# Altium schematic sheet StandardDSUB.SchDoc
size A; SheetNumber: 2; SheetTotal: 2
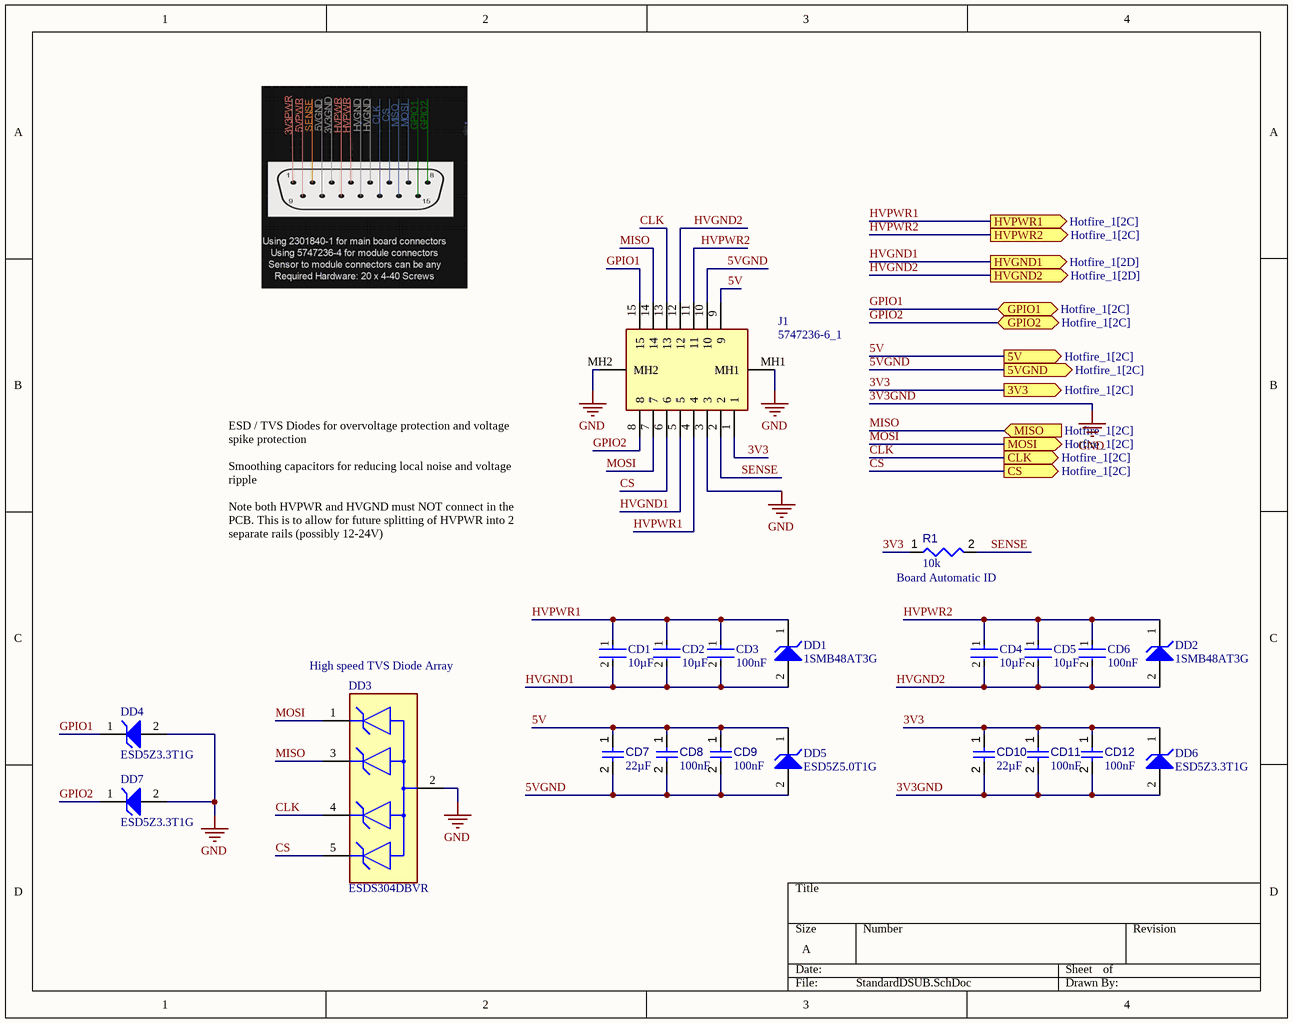
[diagram p0: StandardDSUB.SchDoc]

## Parts
CD1  value 10µF  [FP-CL32-IPC_B]  (hidden comment: CL32B106KMVNNWE)
CD2  value 10µF  [FP-CL32-IPC_B]  (hidden comment: CL32B106KMVNNWE)
CD3  value 100nF  [FP-CL10-IPC_B]  (hidden comment: CL10B104KC8NNNC)
CD4  value 10µF  [FP-CL32-IPC_B]  (hidden comment: CL32B106KMVNNWE)
CD5  value 10µF  [FP-CL32-IPC_B]  (hidden comment: CL32B106KMVNNWE)
CD6  value 100nF  [FP-CL10-IPC_B]  (hidden comment: CL10B104KC8NNNC)
CD7  value 22µF  [CAPC0805(2012)145_L]  (hidden comment: Capacitor 22µF +/-40% 16V 0805)
CD8  value 100nF  [CAPC2013X95X50LL10T25]  (hidden comment: Capacitor 100 nF +/-10% 50 V 0805)
CD9  value 100nF  [CAPC2013X95X50LL10T25]  (hidden comment: Capacitor 100 nF +/-10% 50 V 0805)
CD10  value 22µF  [CAPC0805(2012)145_L]  (hidden comment: Capacitor 22µF +/-40% 16V 0805)
CD11  value 100nF  [CAPC2013X95X50LL10T25]  (hidden comment: Capacitor 100 nF +/-10% 50 V 0805)
CD12  value 100nF  [CAPC2013X95X50LL10T25]  (hidden comment: Capacitor 100 nF +/-10% 50 V 0805)
DD1  1SMB48AT3G  [ONSC-SMB-2-403A-03_H_V]
DD2  1SMB48AT3G  [ONSC-SMB-2-403A-03_H_V]
DD3  ESDS304DBVR  [FP-DBV0005A-IPC_B]
DD4  ESD5Z3.3T1G  [ONSC-SOD-523-2-502-01_V]
DD5  ESD5Z5.0T1G  [ONSC-SOD-523-2-502-01_V]
DD6  ESD5Z3.3T1G  [ONSC-SOD-523-2-502-01_V]
DD7  ESD5Z3.3T1G  [ONSC-SOD-523-2-502-01_V]
J1  5747236-6_1  [57472366]
R1  value 10k  [RESC2013X50X35ML15T15]  (hidden comment: Resistor 10k +/-1% 0805 125 mW)

## Ports
3V3 (out, see Hotfire_1[2C]), 5V (out, see Hotfire_1[2C]), 5VGND (out, see Hotfire_1[2C]), CLK (out, see Hotfire_1[2C]), CS (out, see Hotfire_1[2C]), GPIO1 (bidir, see Hotfire_1[2C]), GPIO2 (bidir, see Hotfire_1[2C]), HVGND1 (out, see Hotfire_1[2D]), HVGND2 (out, see Hotfire_1[2D]), HVPWR1 (out, see Hotfire_1[2C]), HVPWR2 (out, see Hotfire_1[2C]), MISO (in, see Hotfire_1[2C]), MOSI (out, see Hotfire_1[2C])

## Nets
3V3GND: CD10.2 CD11.2 CD12.2 DD3.2(GND) DD4.2(A) DD6.2(A) DD7.2(A) J1.3 J1.MH1 J1.MH2  [also labelled GND]
3V3: CD10.1 CD11.1 CD12.1 DD6.1(K) J1.1 R1.1 ; port 3V3
5V: CD7.1 CD8.1 CD9.1 DD5.1(K) J1.9 ; port 5V
5VGND: CD7.2 CD8.2 CD9.2 DD5.2(A) J1.10 ; port 5VGND
CLK: DD3.4(I/O3) J1.13 ; port CLK
CS: DD3.5(I/O4) J1.6 ; port CS
GPIO1: DD4.1(K) J1.15 ; port GPIO1
GPIO2: DD7.1(K) J1.8 ; port GPIO2
HVGND1: CD1.2 CD2.2 CD3.2 DD1.2(A) J1.5 ; port HVGND1
HVGND2: CD4.2 CD5.2 CD6.2 DD2.2(A) J1.12 ; port HVGND2
HVPWR1: CD1.1 CD2.1 CD3.1 DD1.1(K) J1.4 ; port HVPWR1
HVPWR2: CD4.1 CD5.1 CD6.1 DD2.1(K) J1.11 ; port HVPWR2
MISO: DD3.3(I/O2) J1.14 ; port MISO
MOSI: DD3.1(I/O1) J1.7 ; port MOSI
SENSE: J1.2 R1.2

## Notes on the sheet
- ESD / TVS Diodes for overvoltage protection and voltage spike protection
  Smoothing capacitors for reducing local noise and voltage ripple
  Note both HVPWR and HVGND must NOT connect in the PCB. This is to allow for future splitting of HVPWR into 2 separate rails (possibly 12-24V)
- (near R1) Board Automatic ID
- (near DD3) High speed TVS Diode Array

## Library data of the parts
CD1 CD2 CD4 CD5 = CMP-001-00107-1: Ceramic Capacitor, Multilayer, Ceramic, 63V, 10% +Tol, 10% -Tol, X7R, 15% TC, 10uF, Surface Mount, 1210; Max Operating Temperature: 125°C; RoHS Compliant: Yes; Case/Package: 1210; Mounting Technology: Surface Mount; Capacitor Type: Ceramic; Pins: 2; Min Operating Temperature: -55°C
CD3 CD6 = CMP-001-00108-1: Ceramic Capacitor, Multilayer, Ceramic, 100V, 10% +Tol, 10% -Tol, X7R, 15% TC, 0.1uF, Surface Mount, 0603; Mounting Technology: Surface Mount; Max Operating Temperature: 125°C; Case/Package: 0603; Capacitor Type: Ceramic; Pins: 2; Min Operating Temperature: -55°C; RoHS Compliant: Yes
CD7 CD10 = CMP-001-00081-4: Chip Capacitor, 22µF +/-40%, 16V, 0805, Thickness 1.45 mm; Tolerance: 5%; Voltage Rating: 16V; Mounting Technology: SMT; Pins: 2; Max Operating Temperature: 85°C; Case/Package: 0805; Min Operating Temperature: -55°C
CD8 CD9 CD11 CD12 = CMP-001-00018-6: Chip Capacitor, 100 nF, +/- 10%, 50 V, 0805 (2012 Metric); Capacitor Type: Ceramic; Voltage Rating: 50V; Pins: 2; Max Operating Temperature: 125°C; Min Operating Temperature: -55°C; Mounting Technology: SM; Case/Package: 0805; RoHS Compliant: True; Tolerance: 10%
DD1 DD2 = CMP-004-00036-1: Trans Voltage Suppressor Diode, 600W, 48V V(RWM), Unidirectional, 1 Element, Silicon, DO-214AA; RoHS Compliant: Yes; Pins: 2; Min Operating Temperature: -65°C; Max Operating Temperature: 150°C
DD3 = CMP-004-00037-1: Trans Voltage Suppressor Diode, 85W, 3.6V V(RWM), Unidirectional, 4 Element, Silicon; RoHS Compliant: Yes
DD4 DD6 DD7 = CMP-004-00034-1: Trans Voltage Suppressor Diode, 158W, 3.3V V(RWM), Unidirectional, 1 Element, Silicon; Min Operating Temperature: -55°C; RoHS Compliant: Yes; Pins: 2; Max Operating Temperature: 150°C
DD5 = CMP-004-00035-1: Trans Voltage Suppressor Diode, 240W, 5V V(RWM), Unidirectional, 1 Element, Silicon; Max Operating Temperature: 150°C; Min Operating Temperature: -55°C; RoHS Compliant: Yes; Pins: 2
J1 = CMP-031-000002-4: Male 15 pin DSUB, Used for Hotfire Modules - can connect to Hotfire main board; Manufacturer_Name: TE Connectivity; Source: SamacSys.SchLib; Height: 12.93mm; Arrow Price/Stock: https://www.arrow.com/en/products/5747236-6/te-connectivity; Mouser Price/Stock: https://www.mouser.co.uk/ProductDetail/TE-Connectivity/5747236-6?qs=2De2tSDgB03zVLI%252B5IT1Bw%3D%3D; Mouser Part Number: 571-5747236-6; Manufacturer_Part_Number: 5747236-6; Design Item ID: 5747236-6_1; Datasheet Link: https://www.te.com/commerce/DocumentDelivery/DDEController?Action=srchrtrv&DocNm=82068_AMPLIMITE_Right-Angle_Posted_Conn&DocType=Catalog%20Section&DocLang=English&PartCntxt=5747236-6&DocFormat=pdf; Arrow Part Number: 5747236-6
R1 = CMP-009-00018-5: Chip Resistor, 10 KOhm, +/- 1%, 125 mW, -55 to 155 degC, 0805 (2012 Metric); Power: 125mW; Voltage Rating: 150V; Tolerance: 1%; Pins: 2; Min Operating Temperature: -55°C; Case/Package: 0805; Max Operating Temperature: 155°C; RoHS Compliant: True; Mounting Technology: SM